# EAGLE design 211_MLL-Range-Extender-CAT5_v0016 (EAGLE 9.6.2)
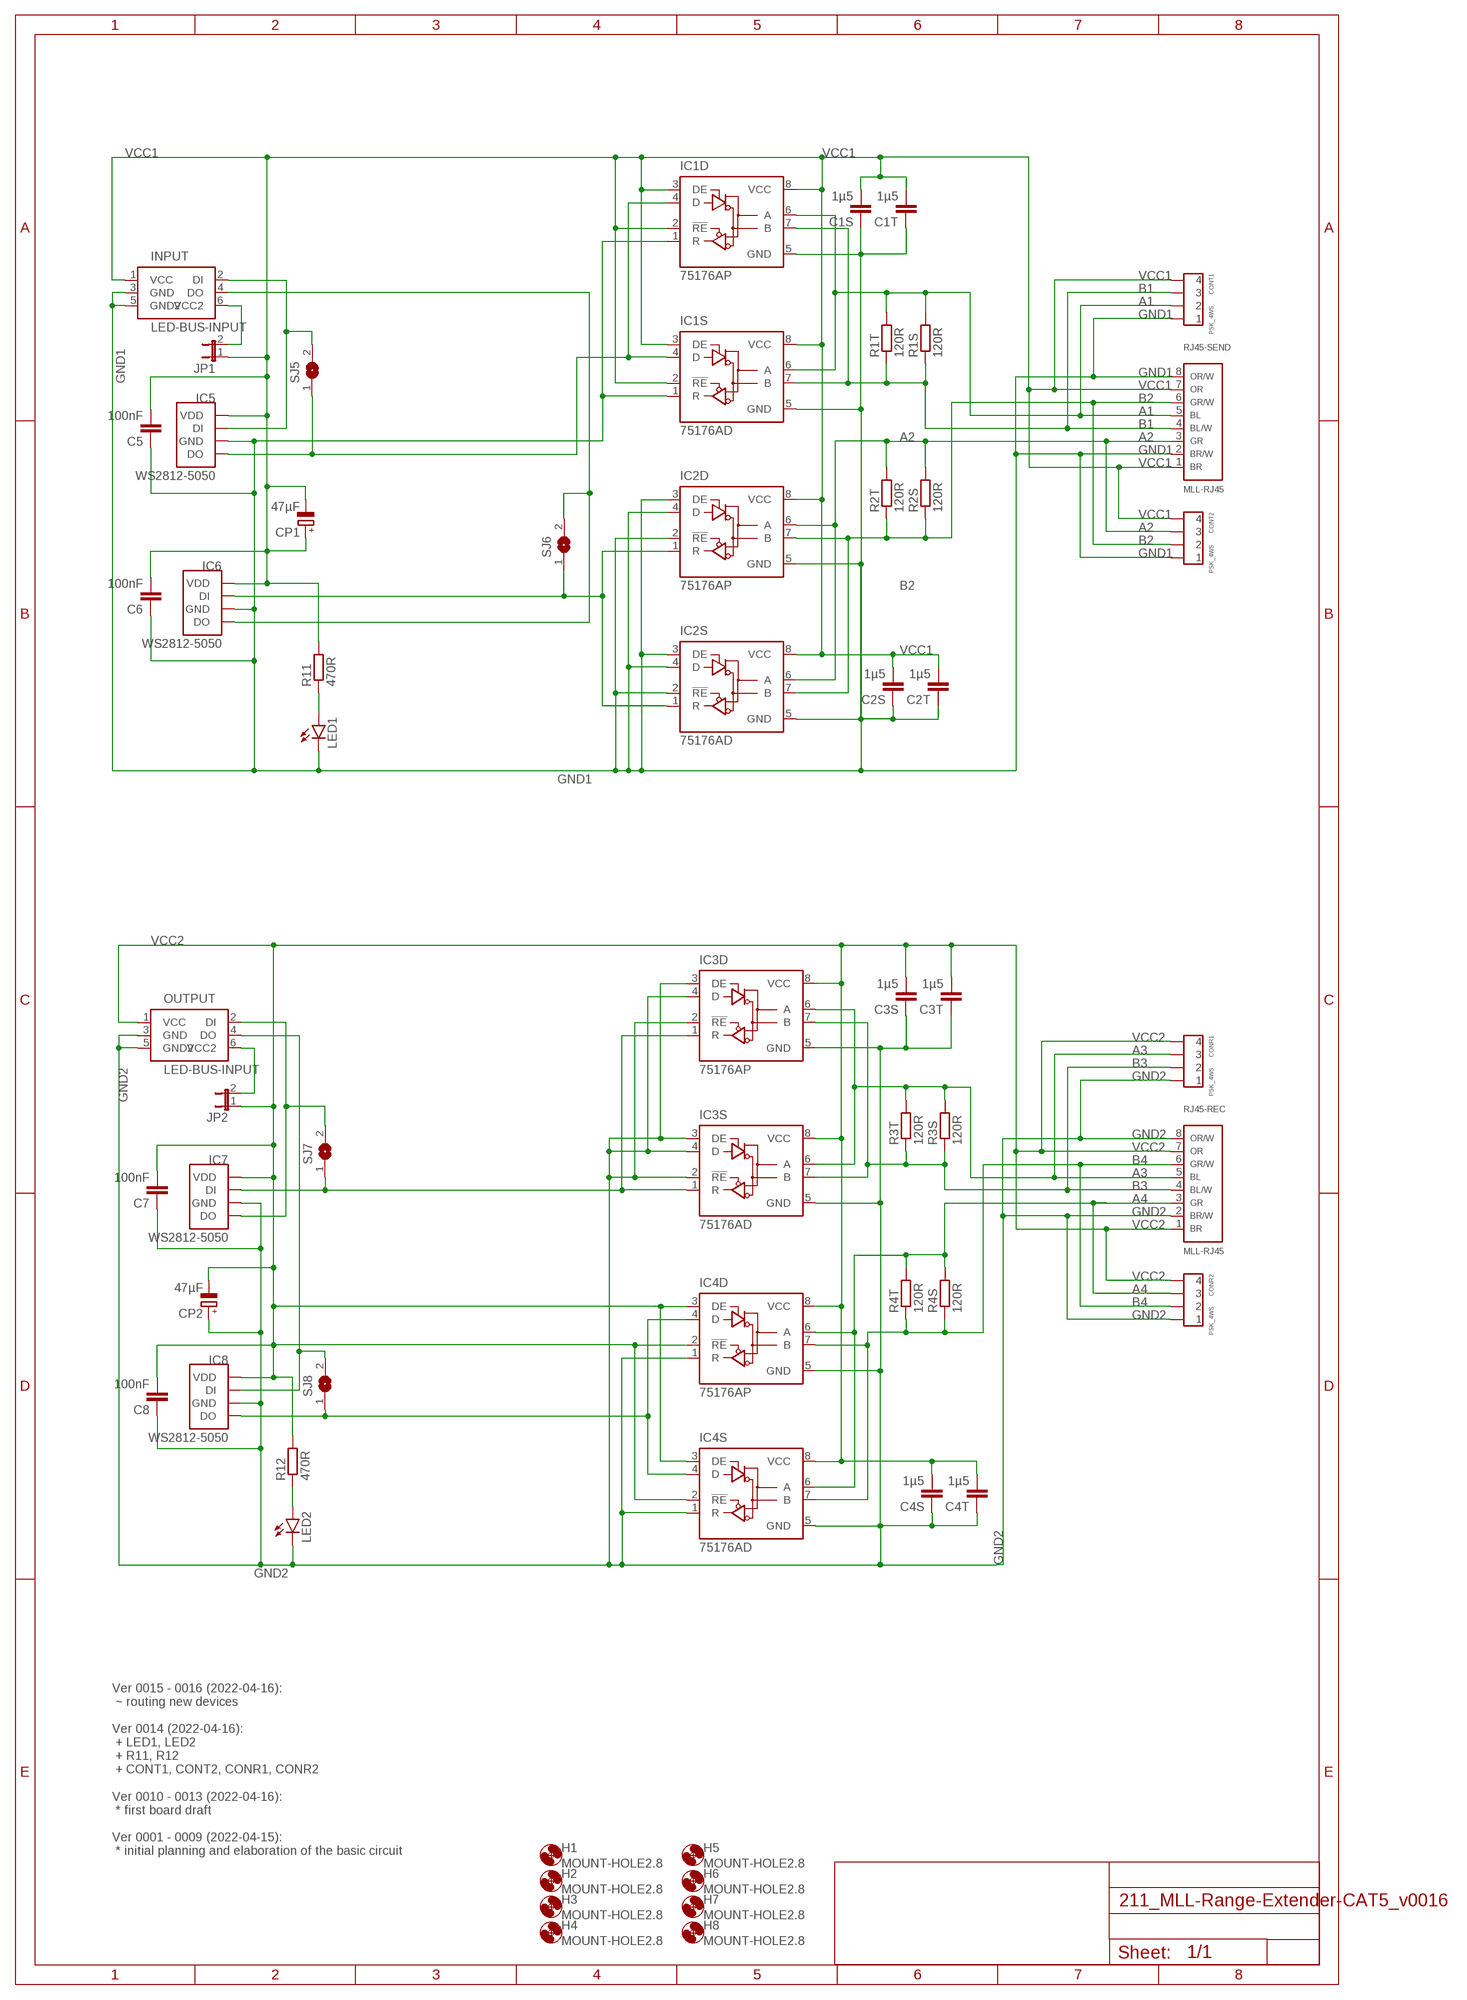
[diagram p0: schematic, sheet 1]

## Parts
C1S  1µ5  C-EUC1210  [C1210]
C1T  1µ5  C-EU050-025X075  [C050-025X075]
C2S  1µ5  C-EUC1210  [C1210]
C2T  1µ5  C-EU050-025X075  [C050-025X075]
C3S  1µ5  C-EUC1210  [C1210]
C3T  1µ5  C-EU050-025X075  [C050-025X075]
C4S  1µ5  C-EUC1210  [C1210]
C4T  1µ5  C-EU050-025X075  [C050-025X075]
C5  100nF  C-EU025-025X050  [C025-025X050]
C6  100nF  C-EU025-025X050  [C025-025X050]
C7  100nF  C-EU025-025X050  [C025-025X050]
C8  100nF  C-EU025-025X050  [C025-025X050]
CONR1  PSK_4WS  [PSSW4-SHORT]
CONR2  PSK_4WS  [PSSW4-SHORT]
CONT1  PSK_4WS  [PSSW4-SHORT]
CONT2  PSK_4WS  [PSSW4-SHORT]
CP1  47µF  CPOL-EUE2-5  [E2-5]
CP2  47µF  CPOL-EUE2-5  [E2-5]
H1  MOUNT-HOLE2.8  [2,8]
H2  MOUNT-HOLE2.8  [2,8]
H3  MOUNT-HOLE2.8  [2,8]
H4  MOUNT-HOLE2.8  [2,8]
H5  MOUNT-HOLE2.8  [2,8]
H6  MOUNT-HOLE2.8  [2,8]
H7  MOUNT-HOLE2.8  [2,8]
H8  MOUNT-HOLE2.8  [2,8]
IC1D  75176AP  [DIL08]
IC1S  75176AD  [D_R-PDSO-G8]
IC2D  75176AP  [DIL08]
IC2S  75176AD  [D_R-PDSO-G8]
IC3D  75176AP  [DIL08]
IC3S  75176AD  [D_R-PDSO-G8]
IC4D  75176AP  [DIL08]
IC4S  75176AD  [D_R-PDSO-G8]
IC5  WS2812-5050  [5050]
IC6  WS2812-5050  [5050]
IC7  WS2812-5050  [5050]
IC8  WS2812-5050  [5050]
INPUT  LED-BUS-INPUT  [IDC6]
JP1  JP1E  [JP1]
JP2  JP1E  [JP1]
LED1  LED3MM  [LED3MM]
LED2  LED3MM  [LED3MM]
OUTPUT  LED-BUS-INPUT  [IDC6]
R1S  120R  R-EU_R1210  [R1210]
R1T  120R  R-EU_0207/10  [0207/10]
R2S  120R  R-EU_R1210  [R1210]
R2T  120R  R-EU_0207/10  [0207/10]
R3S  120R  R-EU_R1210  [R1210]
R3T  120R  R-EU_0207/10  [0207/10]
R4S  120R  R-EU_R1210  [R1210]
R4T  120R  R-EU_0207/10  [0207/10]
R11  470R  R-EU_0207/10  [0207/10]
R12  470R  R-EU_0207/10  [0207/10]
RJ45-REC  MLL-RJ45  [RJ45_U]
RJ45-SEND  MLL-RJ45  [RJ45_U]
SJ5  SJ  [SJ]
SJ6  SJ  [SJ]
SJ7  SJ  [SJ]
SJ8  SJ  [SJ]

## Nets
A1: CONT1.P$2 IC1D.6(A) IC1S.6(A) R1S.2 R1T.2 RJ45-SEND.5(BLUE)
A2: CONT2.P$3 IC2D.6(A) IC2S.6(A) R2S.2 R2T.2 RJ45-SEND.3(GREEN)
A3: CONR1.P$3 IC3D.6(A) IC3S.6(A) R3S.2 R3T.2 RJ45-REC.5(BLUE)
A4: CONR2.P$3 IC4D.6(A) IC4S.6(A) R4S.2 R4T.2 RJ45-REC.3(GREEN)
B1: CONT1.P$3 IC1D.7(B) IC1S.7(B) R1S.1 R1T.1 RJ45-SEND.4(BLUE/WHITE)
B2: CONT2.P$2 IC2D.7(B) IC2S.7(B) R2S.1 R2T.1 RJ45-SEND.6(GREEN/WHITE)
B3: CONR1.P$2 IC3D.7(B) IC3S.7(B) R3S.1 R3T.1 RJ45-REC.4(BLUE/WHITE)
B4: CONR2.P$2 IC4D.7(B) IC4S.7(B) R4S.1 R4T.1 RJ45-REC.6(GREEN/WHITE)
GND1: C1S.1 C1T.1 C2S.1 C2T.1 C5.1 C6.1 CONT1.P$1 CONT2.P$1 IC1D.1(R) IC1D.5(GND) IC1S.1(R) IC1S.5(GND) IC2D.2(!RE) IC2D.3(DE) IC2D.4(D) IC2D.5(GND) IC2S.2(!RE) IC2S.3(DE) IC2S.4(D) IC2S.5(GND) IC5.GND IC6.GND INPUT.3(GND) INPUT.5(GND2) LED1.K(C) RJ45-SEND.2(BROWN/WHITE) RJ45-SEND.8(ORANGE/WHITE)
GND2: C3S.1 C3T.1 C4S.1 C4T.1 C7.1 C8.1 CONR1.P$1 CONR2.P$1 CP2.+ IC3D.2(!RE) IC3D.3(DE) IC3D.4(D) IC3D.5(GND) IC3S.2(!RE) IC3S.3(DE) IC3S.4(D) IC3S.5(GND) IC4D.1(R) IC4D.5(GND) IC4S.1(R) IC4S.5(GND) IC7.GND IC8.GND LED2.K(C) OUTPUT.3(GND) OUTPUT.5(GND2) RJ45-REC.2(BROWN/WHITE) RJ45-REC.8(ORANGE/WHITE)
N$1: JP2.2 OUTPUT.6(VCC2)
N$2: INPUT.6(VCC2) JP1.2
N$3: IC1D.4(D) IC1S.4(D) IC5.DO SJ5.1
N$4: LED1.A R11.1
N$5: IC7.DO OUTPUT.2(DI) SJ7.2
N$6: IC8.DI OUTPUT.4(DO) SJ8.2
N$7: LED2.A R12.1
N$9: IC2D.1(R) IC2S.1(R) IC6.DI SJ6.1
N$13: IC5.DI INPUT.2(DI) SJ5.2
N$15: IC6.DO INPUT.4(DO) SJ6.2
N$17: IC3D.1(R) IC3S.1(R) IC7.DI SJ7.1
N$27: IC4D.4(D) IC4S.4(D) IC8.DO SJ8.1
VCC1: C1S.2 C1T.2 C2S.2 C2T.2 C5.2 C6.2 CONT1.P$4 CONT2.P$4 CP1.+ CP1.- IC1D.2(!RE) IC1D.3(DE) IC1D.8(VCC) IC1S.2(!RE) IC1S.3(DE) IC1S.8(VCC) IC2D.8(VCC) IC2S.8(VCC) IC5.VCC(VDD) IC6.VCC(VDD) INPUT.1(VCC) JP1.1 R11.2 RJ45-SEND.1(BROWN) RJ45-SEND.7(OPRANGE)
VCC2: C3S.2 C3T.2 C4S.2 C4T.2 C7.2 C8.2 CONR1.P$4 CONR2.P$4 CP2.- IC3D.8(VCC) IC3S.8(VCC) IC4D.2(!RE) IC4D.3(DE) IC4D.8(VCC) IC4S.2(!RE) IC4S.3(DE) IC4S.8(VCC) IC7.VCC(VDD) IC8.VCC(VDD) JP2.1 OUTPUT.1(VCC) R12.2 RJ45-REC.1(BROWN) RJ45-REC.7(OPRANGE)

## Notes on the sheet
- Ver 0015 - 0016 (2022-04-16):
   ~ routing new devices
  
  Ver 0014 (2022-04-16):
   + LED1, LED2
   + R11, R12
   + CONT1, CONT2, CONR1, CONR2
  
  Ver 0010 - 0013 (2022-04-16):
   * first board draft
  
  Ver 0001 - 0009 (2022-04-15):
   * initial planning and elaboration of the basic circuit

## Library data of the parts
C1S C1T C2S C2T C3S C3T C4S C4T C5-C8 = rcl:C-EU: CAPACITOR, European symbol; SPICEPREFIX: C
CONR1 CONR2 CONT1 CONT2 = HD_Kontakte:PSK_4
CP1 CP2 = rcl:CPOL-EU: POLARIZED CAPACITOR, European symbol; SPICEPREFIX: C
H1-H8 = holes:MOUNT-HOLE: MOUNTING HOLE with drill center marker
IC1D IC1S IC2D IC2S IC3D IC3S IC4D IC4S = 751xx:75176A: DIFFERENTIAL BUS TRANSCEIVER Source: http://focus.ti.com/lit/ds/symlink/sn75176a.pdf
IC5-IC8 = HD_ICs:WS2812-
INPUT OUTPUT = HD_Kontakte:LED-BUS-INPUT
JP1 JP2 = jumper:JP1E: JUMPER
LED1 LED2 = led:LED: LED OSRAM: - CHIPLED LG R971, LG N971, LY N971, LG Q971, LY Q971, LO R971, LY R971 LH N974, LH R974 LS Q976, LO Q976, LY Q976 LO Q996 - Hyper CHIPLED LW Q18S LB Q993, LB Q99A, LB R99A - SideLED LS A670, LO A670, LY A670, LG A670, LP A670 LB A673, LV A673, LT A673, LW A673 LH A674 LY A675 LS A676, LA A676, LO A676, LY A676, LW A676 LS A679, LY A679, LG A679 - Hyper Micro SIDELED® LS Y876, LA Y876, LO Y876, LY Y876 LT Y87S - SmartLED LW L88C, LW L88S LB L89C, LB L89S, LG L890 LS L89K, LO L89K, LY L89K LS L896, LA L896, LO L896, LY L896 - TOPLED LS T670, LO T670, LY T670, LG T670, LP T670 LSG T670, LSP T670, LSY T670, LOP T670, LYG T670 LG T671, LOG T671, LSG T671 LB T673, LV T673, LT T673, LW T673 LH T674 LS T676, LA T676, LO T676, LY T676, LB T676, LH T676, LSB T676, LW T676 LB T67C, LV T67C, LT T67C, LS T67K, LO T67K, LY T67K, LW E67C LS E67B, LA E67B, LO E67B, LY E67B, LB E67C, LV E67C, LT E67C LW T67C LS T679, LY T679, LG T679 LS T770, LO T770, LY T770, LG T770, LP T770 LB T773, LV T773, LT T773, LW T773 LH T774 LS E675, LA E675, LY E675, LS T675 LS T776, LA T776, LO T776, LY T776, LB T776 LHGB T686 LT T68C, LB T68C - Hyper Mini TOPLED® LB M676 - Mini TOPLED Santana® LG M470 LS M47K, LO M47K, LY M47K Source: http://www.osram.convergy.de LUXEON: - LUMILED® LXK2-PW12-R00, LXK2-PW12-S00, LXK2-PW14-U00, LXK2-PW14-V00 LXK2-PM12-R00, LXK2-PM12-S00, LXK2-PM14-U00 LXK2-PE12-Q00, LXK2-PE12-R00, LXK2-PE12-S00, LXK2-PE14-T00, LXK2-PE14-U00 LXK2-PB12-K00, LXK2-PB12-L00, LXK2-PB12-M00, LXK2-PB14-N00, LXK2-PB14-P00, LXK2-PB14-Q00 LXK2-PR12-L00, LXK2-PR12-M00, LXK2-PR14-Q00, LXK2-PR14-R00 LXK2-PD12-Q00, LXK2-PD12-R00, LXK2-PD12-S00 LXK2-PH12-R00, LXK2-PH12-S00 LXK2-PL12-P00, LXK2-PL12-Q00, LXK2-PL12-R00 Source: www.luxeon.com KINGBRIGHT: KA-3528ASYC Source: www.kingbright.com
R1S R1T R2S R2T R3S R3T R4S R4T R11 R12 = rcl:R-EU_: RESISTOR, European symbol; SPICEPREFIX: R
RJ45-REC RJ45-SEND = HD_Kontakte:MLL-RJ45
SJ5-SJ8 = jumper:SJ: SMD solder JUMPER

## Board
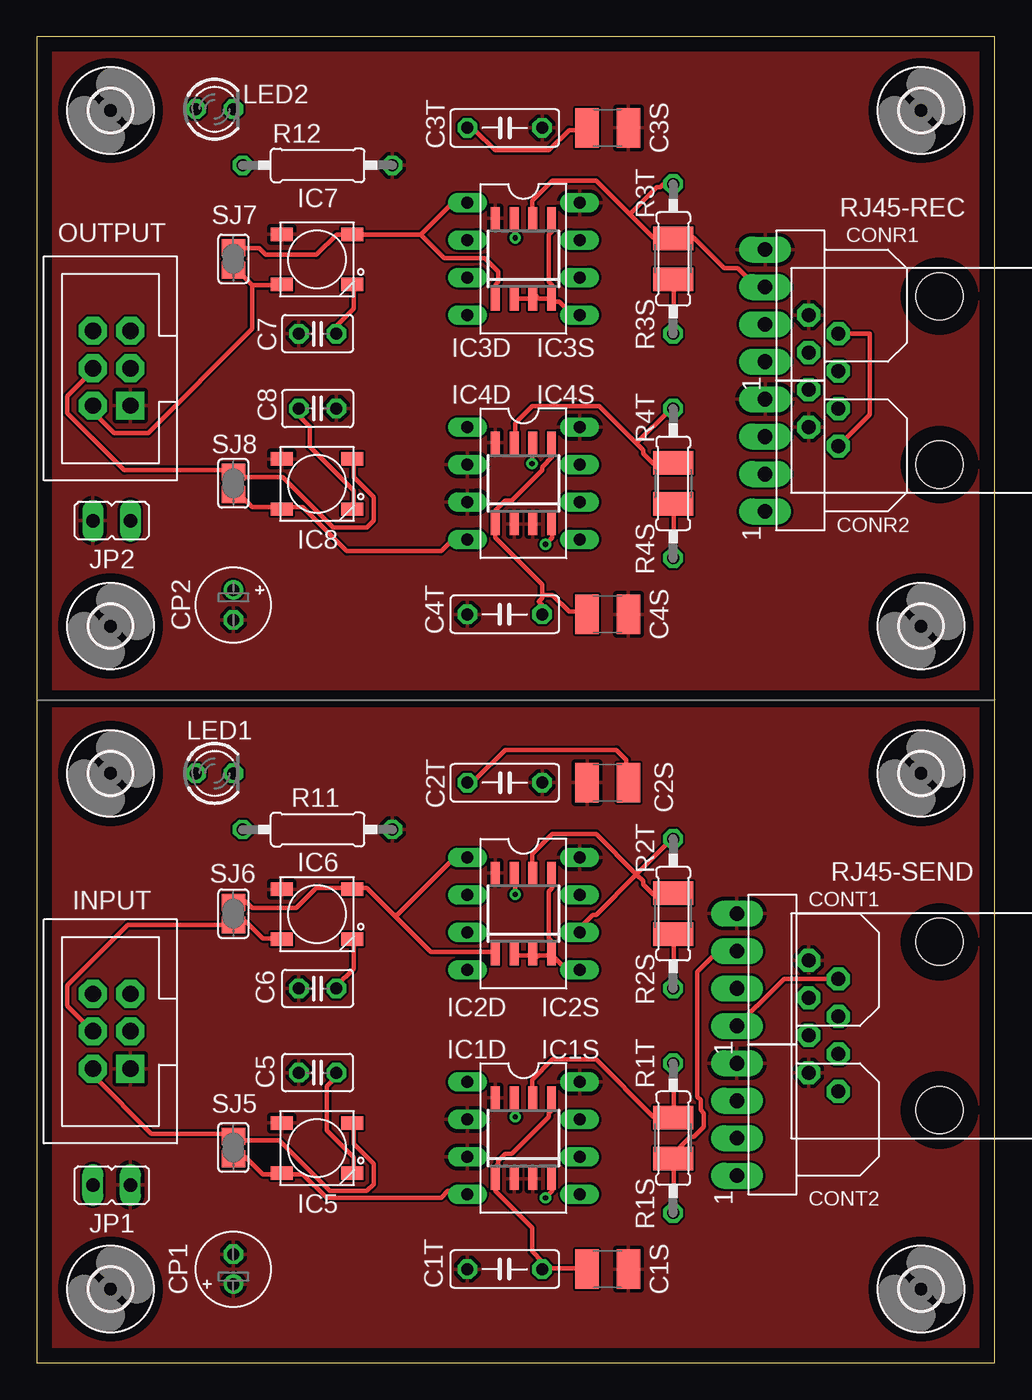
[diagram p1: board, top side]
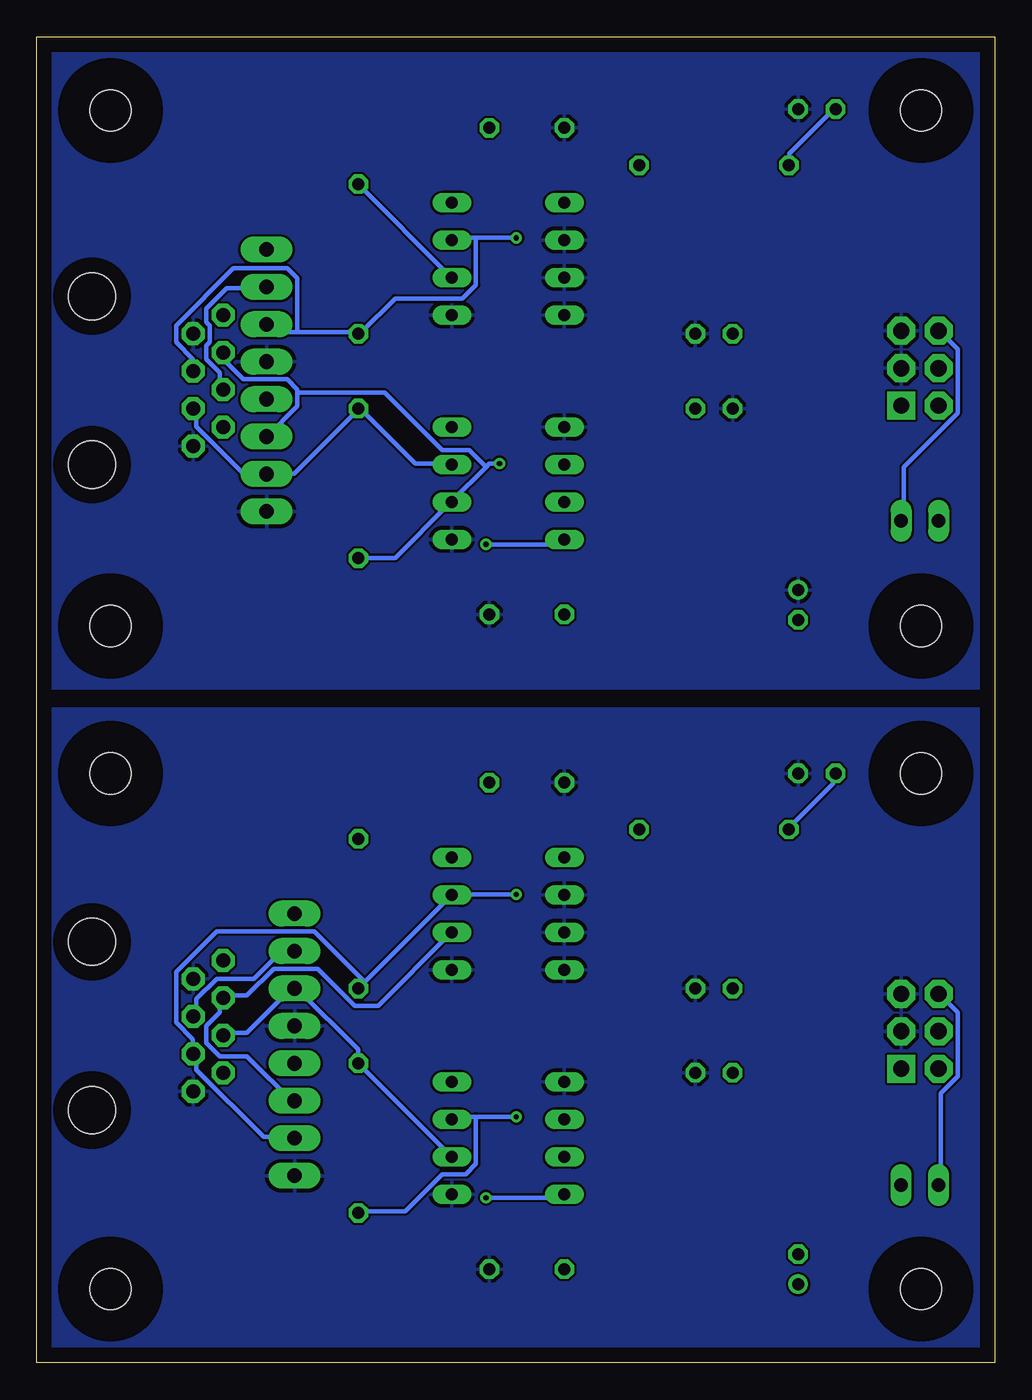
[diagram p2: board, bottom side, seen from below]

Size 65 x 90 mm. Coordinates in mm from the lower left corner, seen from the top.
Outline: 0,0 65,0 65,90 0,90 0,0
Copper layers (1*16): Top 0.035mm / dielectric 1.5mm / Bottom 0.035mm
Design rules "default *": minimum track width 12mil, minimum drill 0.35mm, track to track 6mil, track to pad 6mil, pad to pad 6mil, via to via 6mil, smd to smd 6mil, copper to edge 40mil, drill to drill 6mil, minimum pad ring 10mil, minimum via ring 8mil, stop-mask expansion 4mil, vias tented up to drill 16mil, thermal gap 10mil

### Footprints (pad centres in the part's own frame; a part is rotated, then mirrored left to right if it is on the bottom)
C1210 = smd 1.6 x 2.7: 1 -1.4,0; 2 1.4,0
C050-025X075 = drill 0.813 octagon: 1 -2.54,0; 2 2.54,0
C025-025X050 = drill 0.813 octagon: 1 -1.27,0; 2 1.27,0
PSSW4-SHORT = drill 1 pad 1.778 long: P$1 3.81,-6.465; P$2 1.27,-6.465; P$3 -1.27,-6.465; P$4 -3.81,-6.465
E2-5 = drill 0.813 pad 1.27: + -1.016,0 | drill 0.813 pad 1.27 octagon: - 1.016,0
2,8 = hole 2.8: 0,0
DIL08 = drill 0.813 long: 1 -3.81,-3.81; 2 -1.27,-3.81; 3 1.27,-3.81; 4 3.81,-3.81; 5 3.81,3.81; 6 1.27,3.81; 7 -1.27,3.81; 8 -3.81,3.81
D_R-PDSO-G8 = smd 0.6 x 1.5: 1 -1.905,-2.75; 2 -0.635,-2.75; 3 0.635,-2.75; 4 1.905,-2.75; 5 1.905,2.75; 6 0.635,2.75; 7 -0.635,2.75; 8 -1.905,2.75
5050 = smd 1.5 x 0.9: DI 2.36,1.66; DO -2.44,-1.74; GND 2.36,-1.74; VCC -2.44,1.66
IDC6 = drill 1.1 pad 1.9 square: 1 -2.54,-1.27 | drill 1.1 pad 1.9 octagon: 2 -2.54,1.27; 3 0,-1.27; 4 0,1.27; 5 2.54,-1.27; 6 2.54,1.27
JP1 = drill 0.914 long: 1 0,-1.27; 2 0,1.27
LED3MM = drill 0.813 octagon: A -1.27,0; K 1.27,0
R1210 = smd 1.6 x 2.7: 1 -1.4,0; 2 1.4,0
0207/10 = drill 0.813 octagon: 1 -5.08,0; 2 5.08,0
RJ45_U = drill 0.95 pad 1.56 octagon: 1 19.39,3.175; 2 17.36,4.445; 3 19.39,5.715; 4 17.36,6.985; 5 19.39,8.255; 6 17.36,9.525; 7 19.39,10.795; 8 17.36,12.065 | hole 3.2: 10.5,1.905; 10.5,13.335
SJ = smd 1.168 x 1.6: 1 -0.762,0; 2 0.762,0

### Placement (x,y rotation side)
C1S  38.73,6.35 0 top
C1T  31.75,6.35 180 top
C2S  38.73,39.37 180 top
C2T  31.75,39.37 0 top
C3S  38.73,83.82 0 top
C3T  31.75,83.82 0 top
C4S  38.73,50.8 0 top
C4T  31.75,50.8 180 top
C5  19.05,19.68 180 top
C6  19.05,25.4 180 top
C7  19.05,69.85 180 top
C8  19.05,64.77 0 top
CONR1  55.88,71.75 270 top
CONR2  55.88,61.59 270 top
CONT1  53.98,26.67 270 top
CONT2  53.98,16.51 270 top
CP1  13.34,6.35 90 top
CP2  13.34,51.44 270 top
H1  5,5 0 top
H2  60,5 0 top
H3  5,40 0 top
H4  60,40 0 top
H5  5,50 0 top
H6  5,85 0 top
H7  60,50 0 top
H8  60,85 0 top
IC1D  33.02,15.24 270 top
IC1S  33.02,15.24 0 top
IC2D  33.02,30.48 270 top
IC2S  33.02,30.48 0 top
IC3D  33.02,74.93 270 top
IC3S  33.02,74.93 0 top
IC4D  33.02,59.69 270 top
IC4S  33.02,59.69 0 top
IC5  19.05,14.61 0 top
IC6  19.05,30.48 0 top
IC7  19.05,74.93 0 top
IC8  19.05,59.69 0 top
INPUT  5.08,22.5 90 top
JP1  5.08,12.06 90 top
JP2  5.08,57.15 270 top
LED1  12.06,40.01 0 top
LED2  12.06,85.09 0 top
OUTPUT  5.08,67.5 90 top
R1S  43.18,15.24 90 top
R1T  43.18,15.24 90 top
R2S  43.18,30.48 90 top
R2T  43.18,30.48 90 top
R3S  43.18,74.93 90 top
R3T  43.18,74.93 90 top
R4S  43.18,59.69 270 top
R4T  43.18,59.69 270 top
R11  19.05,36.2 0 top
R12  19.05,81.28 0 top
RJ45-REC  71.75,74.3 180 top
RJ45-SEND  71.75,30.48 180 top
SJ5  13.34,14.61 90 top
SJ6  13.34,30.48 270 top
SJ7  13.34,74.93 270 top
SJ8  13.34,59.69 90 top

### Tracks (layer width: path | path; a pad name or v marks a point on that pad's centre or on a via)
A1
  Top 0.305: IC1S.6 33.6,18.06 33.6,19.2 34.98,20.57 37.95,20.57 41.83,16.69 42.98,16.69 R1S.2 43.2,16.69 43.2,20.12 R1T.2
  Bottom 0.305: RJ45-SEND.5 52.35,22.4 50.75,22.4 47.55,25.6 CONT1.P$2 47.32,25.38 43.2,21.26 43.2,20.34 R1T.2 42.98,20.12 37.03,14.17 IC1D.6
A2
  Top 0.305: 40.69,33.15 41.15,32.69 41.15,32.46 41.83,31.77 42.98,31.77 R2S.2 | 40.69,33.15 37.95,35.89 34.98,35.89 33.6,34.52 33.6,33.38 IC2S.6 | 40.69,33.15 37.95,30.4 37.72,30.4 37.03,29.72 37.03,29.26 IC2D.6 | 40.69,33.15 42.98,35.43 R2T.2
  Bottom 0.305: CONT2.P$3 47.55,17.6 50.75,20.8 52.58,20.8 53.49,21.72 53.49,22.86 52.58,23.77 52.58,24.69 RJ45-SEND.3 52.35,24.92 50.75,24.92 48.92,26.75 45.95,26.75 43.43,24.23 41.83,24.23 37.03,29.03 IC2D.6
A3
  Top 0.305: 40.23,77.95 41.83,76.35 42.98,76.35 R3S.2 43.2,76.35 44.58,76.35 46.63,74.3 47.55,74.3 48.69,73.15 49.38,73.15 CONR1.P$3 | 40.23,77.95 37.95,80.24 34.98,80.24 33.6,78.87 33.6,77.72 IC3S.6 | 40.23,77.95 42.06,79.78 42.29,79.78 42.52,80.01 42.98,80.01 R3T.2
  Bottom 0.305: RJ45-REC.5 52.58,66.06 52.58,67.21 53.49,68.12 53.49,69.04 53.26,69.27 53.26,70.41 53.49,70.64 53.49,71.55 52.12,72.92 49.61,72.92 CONR1.P$3 | IC3D.6 37.03,73.84 43.2,80.01 R3T.2
A4  (via drill 0.35)
  Top 0.305: v33.6,61.04 33.6,62.41 IC4S.6 | R4S.2 43.2,58.06 43.2,54.63 R4T.2
  Bottom 0.305: 47.32,65.84 47.32,64.92 49.38,62.87 CONR2.P$3 | 47.32,65.84 47.32,66.06 48.01,66.75 50.98,66.75 52.35,68.12 52.35,68.58 RJ45-REC.3 | v33.6,61.04 34.29,61.04 34.52,60.81 | 34.52,60.81 36.8,58.52 IC4D.6 37.03,58.29 40.69,54.63 42.98,54.63 R4T.2 | 47.32,65.84 41.38,65.84 37.49,61.95 35.66,61.95 34.52,60.81
B1  (via drill 0.35)
  Top 0.305: R1T.1 43.2,10.29 43.2,13.72 R1S.1 42.98,13.95 44.35,15.32 44.58,15.32 45.26,16 45.26,16.92 45.03,17.14 45.03,17.83 44.81,18.06 44.81,26.52 46.18,27.89 47.32,27.89 CONT1.P$3 | v32.46,16.69 32.46,17.83 IC1S.7
  Bottom 0.305: RJ45-SEND.4 54.18,23.55 54.18,24.69 52.81,26.06 50.29,26.06 48.46,27.89 47.55,27.89 CONT1.P$3 | 35.2,16.69 36.8,16.69 IC1D.7 | 35.2,16.69 v32.46,16.69 | 35.2,16.69 35.2,13.49 35.89,12.8 37.49,12.8 40.01,10.29 42.98,10.29 R1T.1
B2  (via drill 0.35)
  Top 0.305: R2T.1 43.2,25.6 43.2,29.03 R2S.1 | v32.46,31.77 32.46,33.15 IC2S.7
  Bottom 0.305: CONT2.P$2 47.55,15.32 49.61,15.32 54.18,19.89 54.18,20.8 RJ45-SEND.6 54.41,21.03 54.41,21.95 55.55,23.09 55.55,26.52 52.81,29.26 46.18,29.26 42.75,25.83 | v32.46,31.77 36.8,31.77 IC2D.7 37.03,31.55 42.75,25.83 | 42.75,25.83 42.98,25.6 R2T.1 42.75,25.83
B3  (via drill 0.35)
  Top 0.305: v32.46,76.35 32.46,77.5 IC3S.7 | R3S.1 43.2,73.38 43.2,69.95 R3T.1
  Bottom 0.305: 35.2,76.35 36.8,76.35 IC3D.7 | 35.2,76.35 v32.46,76.35 | 47.32,69.95 48.92,69.95 49.38,70.41 CONR1.P$2 | 47.32,69.95 43.2,69.95 R3T.1 42.98,69.95 40.69,72.24 36.12,72.24 35.2,73.15 35.2,76.35 | 47.32,69.95 47.32,73.61 48.01,74.3 51.66,74.3 55.55,70.41 55.55,69.27 54.41,68.12 54.41,67.44 RJ45-REC.4
B4
  Top 0.305: 40.69,62.41 41.15,61.95 41.15,61.72 41.83,61.04 42.98,61.04 R4S.1 | 40.69,62.41 38.18,64.92 33.6,64.92 32.46,63.78 32.46,62.64 IC4S.7 | 40.69,62.41 42.98,64.69 R4T.1
  Bottom 0.305: RJ45-REC.6 54.18,64.69 54.18,63.55 50.98,60.35 49.61,60.35 CONR2.P$2 49.38,60.35 47.55,60.35 43.2,64.69 R4T.1 42.98,64.69 39.32,61.04 37.03,61.04 IC4D.7
GND1
  Top 0.305: 33.38,27.66 33.6,27.66 IC2S.3 33.38,27.66 | 33.38,27.66 32.46,27.66 IC2S.2 | 33.38,27.66 33.6,27.43 33.83,27.43 34.06,27.66 34.75,27.66 IC2S.4 | IC2S.5 34.98,33.15 34.98,32.23 34.75,32 34.75,28.8 34.98,28.57 34.98,27.89 IC2S.4 | IC5.GND 21.49,13.03 21.49,13.95 19.66,15.77 19.66,18.75 20.12,19.2 20.12,19.66 C5.1 | IC6.GND 21.49,28.57 21.49,26.75 20.34,25.6 C6.1 | 34.29,6.4 34.29,6.86 33.6,7.54 33.6,9.14 31.09,11.66 31.09,12.34 IC1S.1 31.09,12.57 31.09,13.26 31.32,13.49 31.32,13.72 31.77,14.17 32.23,14.17 34.75,16.69 34.75,16.92 34.98,17.14 34.98,17.83 IC1S.5 | 34.29,6.4 C1T.1 34.29,6.4 | 34.29,6.4 37.26,6.4 C1S.1 | C2S.1 40.01,39.55 40.01,40.92 39.32,41.6 31.77,41.6 29.72,39.55 29.26,39.55 C2T.1 | IC2S.4 34.98,27.66 35.89,26.75 36.8,26.75 IC2D.5 | CONT1.P$1 48.86,24.21 48.89,24.21 50.72,26.04 RJ45-SEND.2
  pour Bottom: 0,44.45 0,0 64.77,0 64.77,44.45
GND2
  Top 0.305: 33.38,72.24 33.6,72.24 IC3S.3 33.38,72.24 | 33.38,72.24 32.46,72.24 IC3S.2 | 33.38,72.24 33.6,72.47 33.83,72.47 34.06,72.24 34.75,72.24 IC3S.4 | IC3S.5 34.98,77.5 34.98,76.81 34.75,76.58 34.75,73.38 34.98,73.15 34.98,72.24 IC3S.4 | IC8.GND 21.49,58.06 21.49,59.21 18.52,62.18 18.52,63.55 17.83,64.24 17.83,64.69 C8.1 | IC7.GND 21.49,73.15 21.49,71.55 20.34,70.41 20.34,69.95 C7.1 | 34.29,52.12 34.29,51.89 34.06,51.66 34.29,51.44 34.29,50.98 C4T.1 | 34.29,52.12 34.29,52.81 31.09,56.01 31.09,56.92 IC4S.1 31.09,57.15 31.09,57.84 31.77,58.52 32.23,58.52 34.29,60.58 34.29,60.81 34.98,61.49 34.98,62.41 IC4S.5 | 34.29,52.12 34.98,52.12 36.12,50.98 37.26,50.98 C4S.1 | C3S.1 37.26,83.67 36.12,83.67 34.75,82.3 31.09,82.3 29.72,83.67 29.26,83.67 C3T.1 | IC3S.4 34.98,72.01 35.43,72.01 36.12,71.32 36.8,71.32 IC3D.5 | RJ45-REC.2 56.52,69.85 56.52,64.35 RJ45-REC.8
  pour Bottom: 0,45.72 64.77,45.72 64.77,90.17 0,90.17
N$1
  Bottom 0.305: JP2.2 6.17,57.15 6.17,60.81 2.52,64.47 2.52,68.81 3.66,69.95 OUTPUT.6
N$2
  Bottom 0.305: JP1.2 3.66,12.12 3.66,18.29 2.52,19.43 2.52,23.77 3.66,24.92 INPUT.6
N$3  (via drill 0.35)
  Top 0.305: SJ5.1 13.49,13.95 14.17,13.95 15.32,12.8 16.46,12.8 IC5.DO 16.69,12.8 18.06,12.8 19.66,11.2 27.43,11.2 27.89,11.66 28.8,11.66 29.03,11.43 IC1D.4 | v34.52,11.2 34.98,11.66 34.98,12.34 IC1S.4
  Bottom 0.305: v34.52,11.2 29.49,11.2 29.26,11.43 IC1D.4
N$4
  Bottom 0.305: LED1.A 10.97,40.01 10.97,39.32 13.95,36.35 R11.1
N$5
  Top 0.305: 14.63,73.15 16.46,73.15 IC7.DO | 14.63,73.15 13.49,74.3 12.8,74.3 SJ7.2 | 14.63,73.15 14.63,70.18 7.54,63.09 5.26,63.09 3.89,64.47 3.89,64.92 OUTPUT.2
N$6
  Top 0.305: IC8.DI 21.49,61.27 21.49,60.12 22.86,58.75 22.86,57.15 22.4,56.69 20.12,56.69 16.69,60.12 13.95,60.12 13.49,60.58 12.8,60.58 SJ8.2 12.57,60.58 5.94,60.58 2.06,64.47 2.06,65.61 3.66,67.21 3.66,67.44 OUTPUT.4
N$7
  Bottom 0.305: R12.1 13.95,81.38 13.95,82.07 10.97,85.04 LED2.A
N$9
  Top 0.305: SJ6.1 13.49,31.32 14.17,31.32 14.63,30.86 17.6,30.86 18.97,32.23 21.26,32.23 IC6.DI 21.49,32.23 22.4,32.23 24.23,30.4 | 24.23,30.4 26.75,27.89 31.09,27.89 IC2S.1 | 24.23,30.4 24.46,30.4 28.35,34.29 29.03,34.29 IC2D.1
N$13
  Top 0.305: IC5.DI 21.49,16.23 21.49,14.86 22.86,13.49 22.86,12.12 22.4,11.66 19.89,11.66 16.46,15.09 13.72,15.09 13.49,15.32 SJ5.2 13.26,15.54 7.77,15.54 3.89,19.43 3.89,19.89 INPUT.2
N$15
  Top 0.305: IC6.DO 16.46,28.8 15.32,28.8 14.17,29.95 13.72,29.95 13.49,29.72 SJ6.2 13.26,29.72 6.17,29.72 2.06,25.6 2.06,24.23 3.66,22.63 INPUT.4
N$17
  Top 0.305: 26.06,76.58 21.49,76.58 IC7.DI 21.26,76.58 20.34,76.58 18.97,75.21 15.54,75.21 15.09,75.67 12.8,75.67 SJ7.1 | 26.06,76.58 28.12,78.64 29.03,78.64 IC3D.1 | 26.06,76.58 27.66,74.98 30.4,74.98 31.32,74.07 31.32,73.38 31.09,73.15 31.09,72.24 IC3S.1
N$27  (via drill 0.35)
  Top 0.305: SJ8.1 12.8,58.75 13.95,58.75 14.63,58.06 16.46,58.06 IC8.DO 16.69,58.06 18.06,58.06 21.03,55.09 27.43,55.09 28.12,55.78 29.03,55.78 IC4D.4 | v34.52,55.55 34.98,56.01 34.98,56.92 IC4S.4
  Bottom 0.305: v34.52,55.55 29.49,55.55 29.26,55.78 IC4D.4
VCC1
  pour Top: 0,44.45 64.77,44.45 64.77,0 0,0
VCC2
  pour Top: 0,90.17 0,45.72 64.77,45.72 64.77,90.17